# Altium project YuWatch.PrjPcb
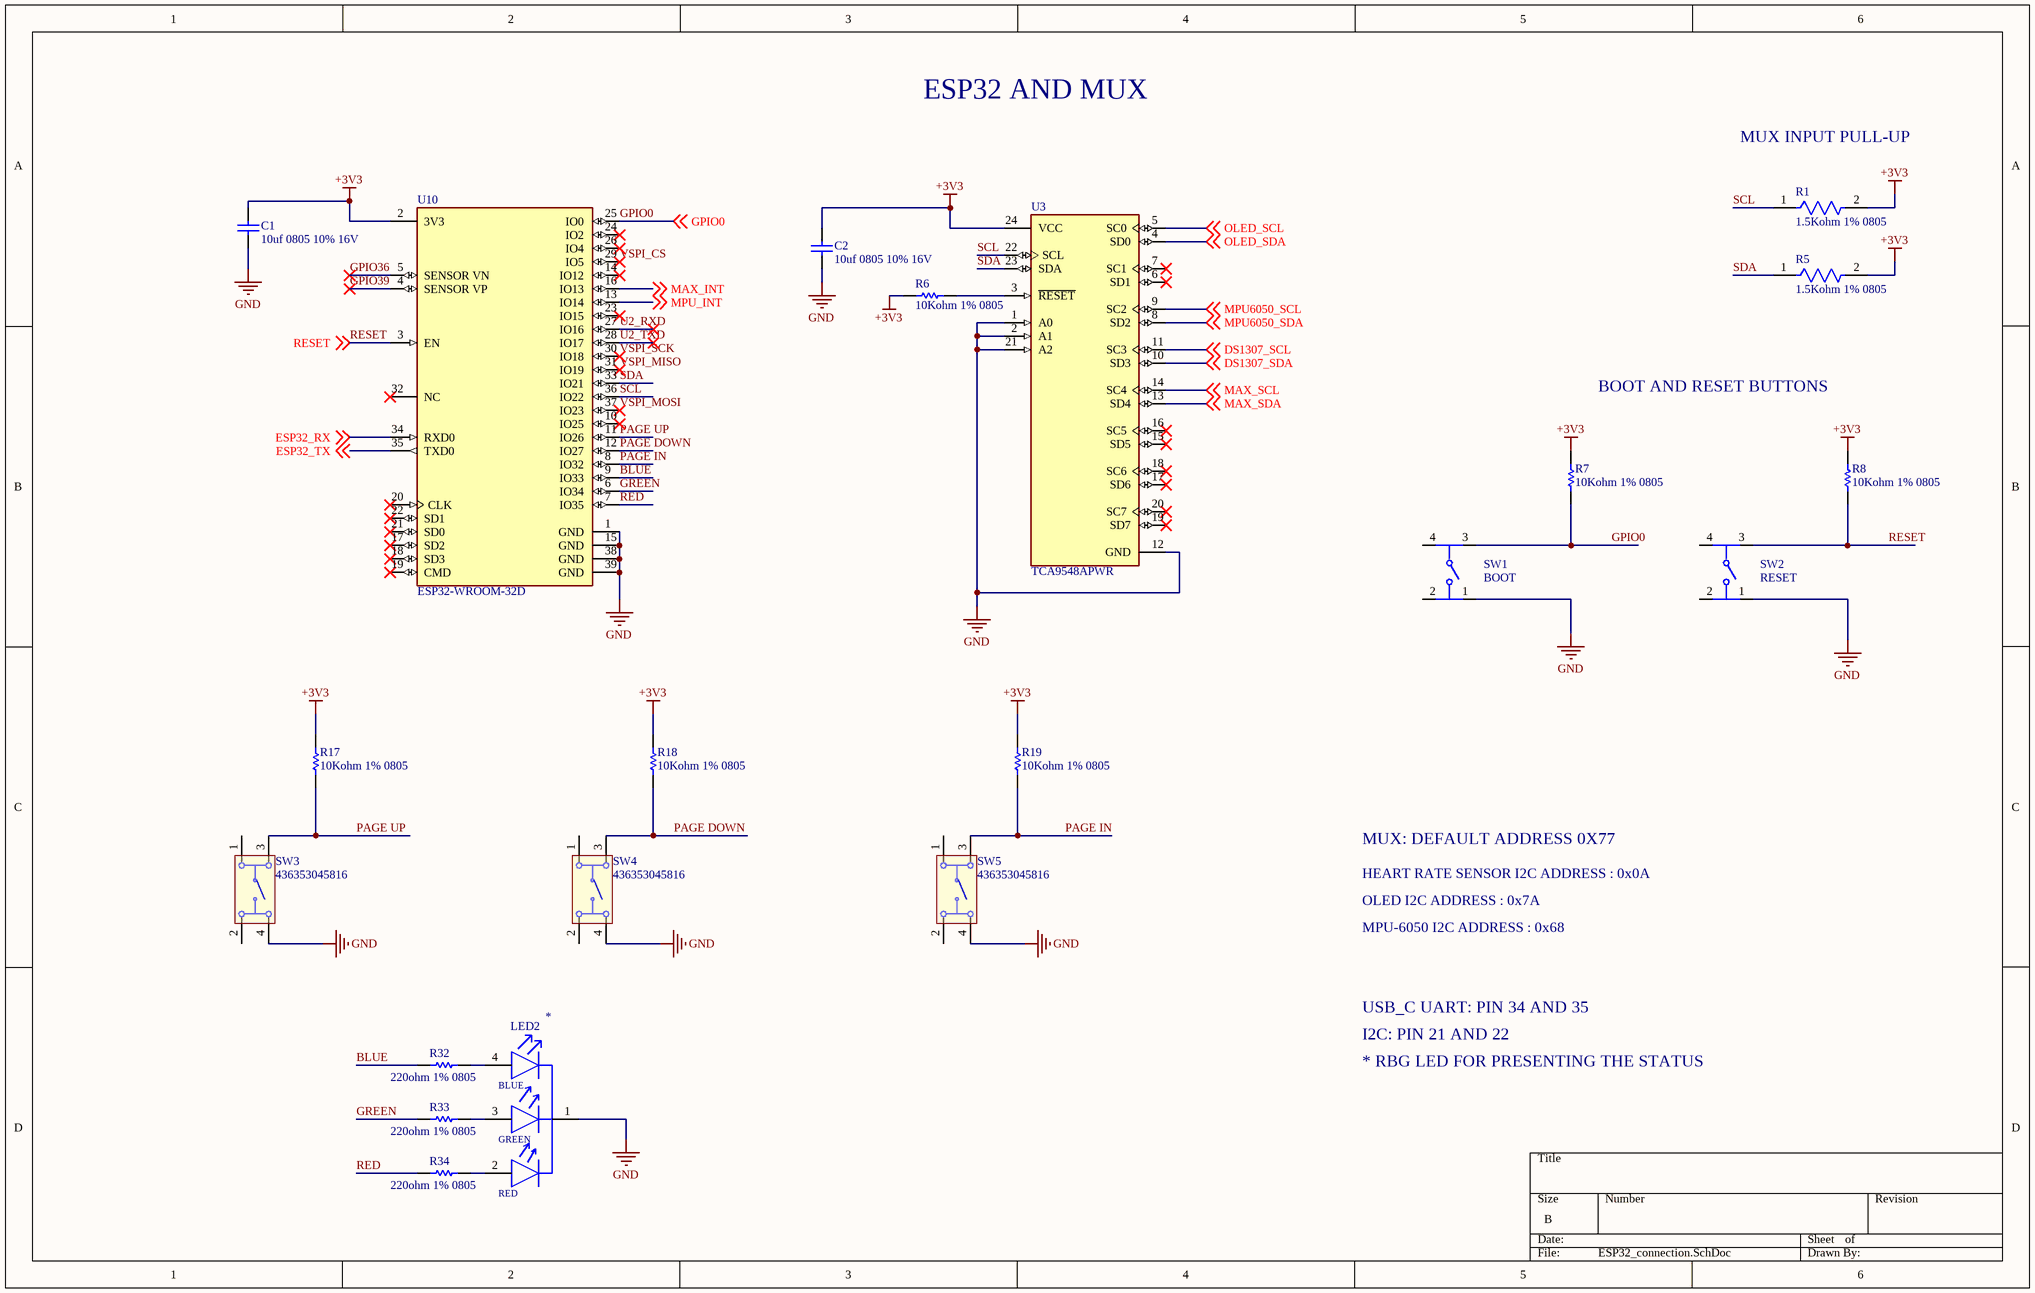
[diagram p0: ESP32_connection.SchDoc]
3 sheets, 79 parts. Net scope: global (net labels, ports and power ports of the same name join across sheets).
Board file: Yuwatch_01.PcbDoc
Sheets:
  ESP32_connection.SchDoc
  USBdrive_charging.SchDoc
  I2C bus components.SchDoc

## Sheet ESP32_connection.SchDoc
size B; SheetNumber: 1; SheetTotal: 3

### Parts
C1  10uf 0805 10% 16V  [CAPC2013X140X50ML20T25]
C2  10uf 0805 10% 16V  [CAPC2013X140X50ML20T25]
LED2  APTF1616SEJ3ZGGVBDC  [FP-APTF1616SEJ3ZGGVBDC-MFG]  (value not drawn)
R1  1.5Kohm 1% 0805  [FP-RC2012-IPC_B]
R5  1.5Kohm 1% 0805  [FP-RC2012-IPC_B]
R6  10Kohm 1% 0805  [RESC2013X60X35NL10T20]
R7  10Kohm 1% 0805  [RESC2013X60X35NL10T20]
R8  10Kohm 1% 0805  [RESC2013X60X35NL10T20]
R17  10Kohm 1% 0805  [RESC2013X60X35NL10T20]
R18  10Kohm 1% 0805  [RESC2013X60X35NL10T20]
R19  10Kohm 1% 0805  [RESC2013X60X35NL10T20]
R32  220ohm 1% 0805  [RESC2013X70X40NL20T20]
R33  220ohm 1% 0805  [RESC2013X70X40NL20T20]
R34  220ohm 1% 0805  [RESC2013X70X40NL20T20]
SW1  BOOT  [FP-PTS810_SJG_250_SMTR_LF-MFG]
SW2  RESET  [FP-PTS810_SJG_250_SMTR_LF-MFG]
SW3  436353045816  [436353045816]
SW4  436353045816  [436353045816]
SW5  436353045816  [436353045816]
U3  TCA9548APWR  [FP-PW0024A-MFG]
U10  ESP32-WROOM-32D  [FP-ESP32-WROOM-32D-MFG]

### Nets
+3V3: C1.2 C2.2 R1.2 R5.2 R6.1 R7.1 R8.1 R17.1 R18.1 R19.1 U3.8(SD2) U3.24(VCC) U10.2(3V3) ; off-sheet MPU6050_SDA  [also labelled MPU6050_SDA]
GND: C1.1 C2.1 LED2.1(COMMON_CATHODE) SW1.1 SW2.1 SW3.4 SW4.4 SW5.4 U3.1(A0) U3.2(A1) U3.12(GND) U3.21(A2) U10.1(GND) U10.15(GND) U10.38(GND) U10.39(GND)
MAX_SCL: U3.14(SC4) ; off-sheet MAX_SCL  [project net +1V8]
BLUE: R32.1 U10.9(IO33)
DS1307_SCL: U3.11(SC3) ; off-sheet DS1307_SCL
DS1307_SDA: U3.10(SD3) ; off-sheet DS1307_SDA
ESP32_RX: U10.34(RXD0) ; off-sheet ESP32_RX
ESP32_TX: U10.35(TXD0) ; off-sheet ESP32_TX
GPIO0: R7.2 SW1.3 U10.25(IO0) ; off-sheet GPIO0
GPIO36: U10.5(SENSOR_VN)
GPIO39: U10.4(SENSOR_VP)
GREEN: R33.1 U10.6(IO34)
MAX_INT: U10.16(IO13) ; off-sheet MAX_INT
MAX_SDA: U3.13(SD4) ; off-sheet MAX_SDA
MPU6050_SCL: U3.9(SC2) ; off-sheet MPU6050_SCL
MPU_INT: U10.13(IO14) ; off-sheet MPU_INT
OLED_SCL: U3.5(SC0) ; off-sheet OLED_SCL
OLED_SDA: U3.4(SD0) ; off-sheet OLED_SDA
PAGE DOWN: R18.2 SW4.3 U10.12(IO27)
PAGE IN: R19.2 SW5.3 U10.8(IO32)
PAGE UP: R17.2 SW3.3 U10.11(IO26)
RED: R34.1 U10.7(IO35)
RESET: R8.2 SW2.3 U10.3(EN) ; off-sheet RESET
SCL: R1.1 U3.22(SCL) U10.36(IO22)
SDA: R5.1 U3.23(SDA) U10.33(IO21)
U2_RXD: U10.27(IO16)
U2_TXD: U10.28(IO17)
VSPI_CS: U10.29(IO5)
VSPI_MISO: U10.31(IO19)
VSPI_MOSI: U10.37(IO23)
VSPI_SCK: U10.30(IO18)
NetLED2_2: LED2.2(RED_A) R34.2
NetLED2_3: LED2.3(GREEN_A) R33.2
NetLED2_4: LED2.4(BLUE_A) R32.2
NetR6_2: R6.2 U3.3(~{RESET})

Not connected (* = marked no-connect by the designer): SW1 2 4; SW2 2 4; SW3 1 2; SW4 1 2; SW5 1 2; U3 6(SD1)* 7(SC1)* 15(SD5)* 16(SC5)* 17(SD6)* 18(SC6)* 19(SD7)* 20(SC7)*; U10 10(IO25)* 14(IO12)* 17(SD2)* 18(SD3)* 19(CMD)* 20(CLK)* 21(SD0)* 22(SD1)* 23(IO15)* 24(IO2)* 26(IO4)* 32(NC)*

### Notes on the sheet
- ESP32 AND MUX
- MUX INPUT PULL-UP
- BOOT AND RESET BUTTONS
- MUX: DEFAULT ADDRESS 0X77
- HEART RATE SENSOR I2C ADDRESS : 0x0A
- OLED I2C ADDRESS : 0x7A
- MPU-6050 I2C ADDRESS : 0x68
- (near LED2) *
- USB_C UART: PIN 34 AND 35
- I2C: PIN 21 AND 22
- (near LED2) BLUE
- * RBG LED FOR PRESENTING THE STATUS
- (near LED2) GREEN
- (near LED2) RED

### Library data of the parts
C1 C2 = CMP-1036-04927-2: Part Number: 0805YD106KAT2A; Manufacturer: AVX Interconnect / Elco
LED2 = CMP-44529-000025-1: LED RGB CLEAR 4SMD; Luminous Intensity: 140mcd; Test Current: 20mA; Forward Voltage: 3.3V; Lens Color: Colorless; Illumination Color: Blue; Viewing Angle: 120°; Dominant Wavelength: 470nm; Width: 1.6mm; Mount: Surface Mount; Height: 0.9mm; Case/Package: 0606; Max Operating Temperature: 85°C; Color: Blue; Lens Transparency: Clear; Min Operating Temperature: -40°C; Forward Current: 20mA; Length: 1.6mm; Packaging: Tape and Reel; Package Quantity: 2000
R1 R5 = CMP-13261-002474-1: Res Thick Film 0805 1.5kΩ 1% 0.125W ±100ppm/°C Molded SMD T/R; Resistance: 1.5kR; Voltage Rating (DC): 150V; Max Power Dissipation: 125mW; Case Code (Metric): 2012; Packaging: Tape and Reel; Features: Moisture Resistant; Temperature Coefficient: 100ppm/°C; Case Code (Imperial): 0805; Min Operating Temperature: -55°C; Contact Plating: Tin; Tolerance: 1%; Composition: Thick Film; Height: 0.024inch; Lead Free: Lead Free; Max Operating Temperature: 155°C; Length: 0.079inch; Radiation Hardening: No; Case/Package: 0805; Width: 0.049inch; Number of Terminations: 2
R6-R8 R17-R19 = CMP-1659-00013-4: Chip Resistor, 10 KOhm, +/- 1%, 0.125 W, -55 to 155 degC, 0805 (2012 Metric), RoHS, Tape and Reel; Manufacturer: Yageo; Voltage Rating: 150 V; Mount: Surface Mount; ComponentLink1Description: Manufacturer URL; ComponentLink2URL: http://www.yageo.com/documents/recent/PYu-RC_Group_51_RoHS_L_04.pdf; Pins: 2; Length: 2 mm; Min Operating Temperature: -55 degC; Height: 0.5 mm; Mounting Technology: Surface Mount; RoHSCompliant: true; REACH SVHC: No SVHC; ComponentLink1URL: http://www.yageo.com/; Max Operating Temperature: 155 degC; PackageReference: 0805; DatasheetVersion: Rev. 4, 02/2016; Package Quantity: 5000; Packaging: Tape and Reel; ComponentLink2Description: Datasheet; PackageDescription: 2-Pin Surface Mounted Device, Body 2 x 1.25 mm
R32-R34 = CMP-2001-00044-1: Part Number: ERJ6ENF2200V; Manufacturer: Panasonic
SW1 SW2 = CMP-10040-000011-1: SWITCH TACTILE SPST-NO 0.05A 16V; Manufacturer: C&K Components; Manufacturer Part Number: PTS810 SJG 250 SMTR LFS; Electromechanical Life: 100000Cycles; Contact Resistance: 500mΩ; Operating Force: 400gf; Current Rating: 50mA; Voltage Rating Dc: 16V; Device Class L2: Switches; Device Class L1: Electromechanical; ComponentLink2URL: https://www.ckswitches.com/media/1476/pts810.pdf; Digikey Description: SWITCH TACTILE SPST-NO 0.05A 16V; RoHS: TRUE; Temperature Range Low: -40°C; Temperature Range High: +85°C; Automotive: No; Category: Switch; ComponentLink2Description: Datasheet; Device Class L3: Tactile Switches; Mouser Description: Switch Tactile N.O. SPST Button J-Bend 0.05A 16VDC 100000Cycles 3.92N SMD T/R; Throw Configuration: SPST-NO; Package: PTS810 SJG 250 SMTR LFS; Height: 2.7mm; Octopart: https://octopart.com/pts810sjg250smtrlfs-c%26k+components-29380277; Temperature: -40°C to +85°C; Lead Free: Yes
SW3-SW5 = CMP-1464-00002-1: WS-TASU J-Bend J-Bend SMD Tact Switch with boss design 4.7X3.5 mm side push; Manufacturer: Wuerth Elektronik; ComponentLink1Description: Manufacturer URL; ComponentLink2Description: Datasheet; PackageReference: 436353045816; ComponentLink1URL: http://www.we-online.com; PartNumber: 436353045816; ComponentLink2URL: http://katalog.we-online.de/em/datasheet/436353045816.pdf
U3 = CMP-04892-000002-1: IC I2C SW 8CH W/RESET 24TSSOP; Manufacturer: Texas Instruments; Number Of Circuits: 1; Mux Demux Ratio: 1:8; Nominal Supply Current: 2-50uA; Interface: I2C,SMBus; Min Supply Voltage: 1.65V; Standoff Height: 0.05mm; Max Supply Voltage: 5.5V; Device Class L2: Interface ICs; ComponentLink2Description: Datasheet; Ipc Land Pattern Name: SOP65P640X120-24; Category: IC; Device Class L1: Integrated Circuits (ICs); Manufacturer Part Number: TCA9548APWR; RoHS: TRUE; Temperature Range High: +85°C; Digikey Description: IC I2C SW 8CH W/RESET 24TSSOP; Temperature Range Low: -40°C; Lead Free: Yes; Package: PW0024A; ComponentLink2URL: http://www.ti.com/lit/ds/symlink/tca9548a.pdf; Device Class L3: Multiplexers; Ambient Temperature Range Low: -40°C; Mouser Description: Low-Voltage 8-Channel I2C Switch With Reset 24-TSSOP -40 to 85; Temperature: -40°C to +85°C; Octopart: https://octopart.com/tca9548apwr-texas+instruments-22266789; Ambient Temperature Range High: +85°C; Automotive: No; Height: 1.2mm
U10 = CMP-194065-000003-1: WIFI MODULE 32MBITS SPI FLASH; Manufacturer: Espressif Systems; Max Supply Voltage: 3.6V; Nominal Supply Current: 500mA; Max Frequency: 2484MHz; Number Of Adc Channels: 16; Number Of Gpio: 32; Interface: I2C,SPI,UART,Ethernet,I2S,Other; Data Rate: 150Mbits/s; Min Supply Voltage: 3V; Bandwidth: 72MHz; Sensitivity: -98dBm; Octopart: https://octopart.com/esp32-wroom-32d-espressif+systems-91040050; Package: ESP32-WROOM-32D; ComponentLink2URL: https://www.espressif.com/sites/default/files/documentation/esp32-wroom-32d_esp32-wroom-32u_datasheet_en.pdf; Lead Free: Yes; Category: UNK; Mouser Description: Wi-Fi/BT BLE Module ESP32-D0WD, SPI Flash, UART, P; Device Class L1: Integrated Circuits (ICs); RoHS: TRUE; Temperature Range Low: -40°C; ComponentLink2Description: Datasheet; Digikey Description: WIFI MODULE 32MBITS SPI FLASH; Height: 3.2mm; Temperature: -40°C to +85°C; Manufacturer Part Number: ESP32-WROOM-32D; Device Class L3: Transceivers; Device Class L2: RF Semiconductors and Devices; Temperature Range High: +85°C; Automotive: No

## Sheet USBdrive_charging.SchDoc
size B; SheetNumber: 2; SheetTotal: 3
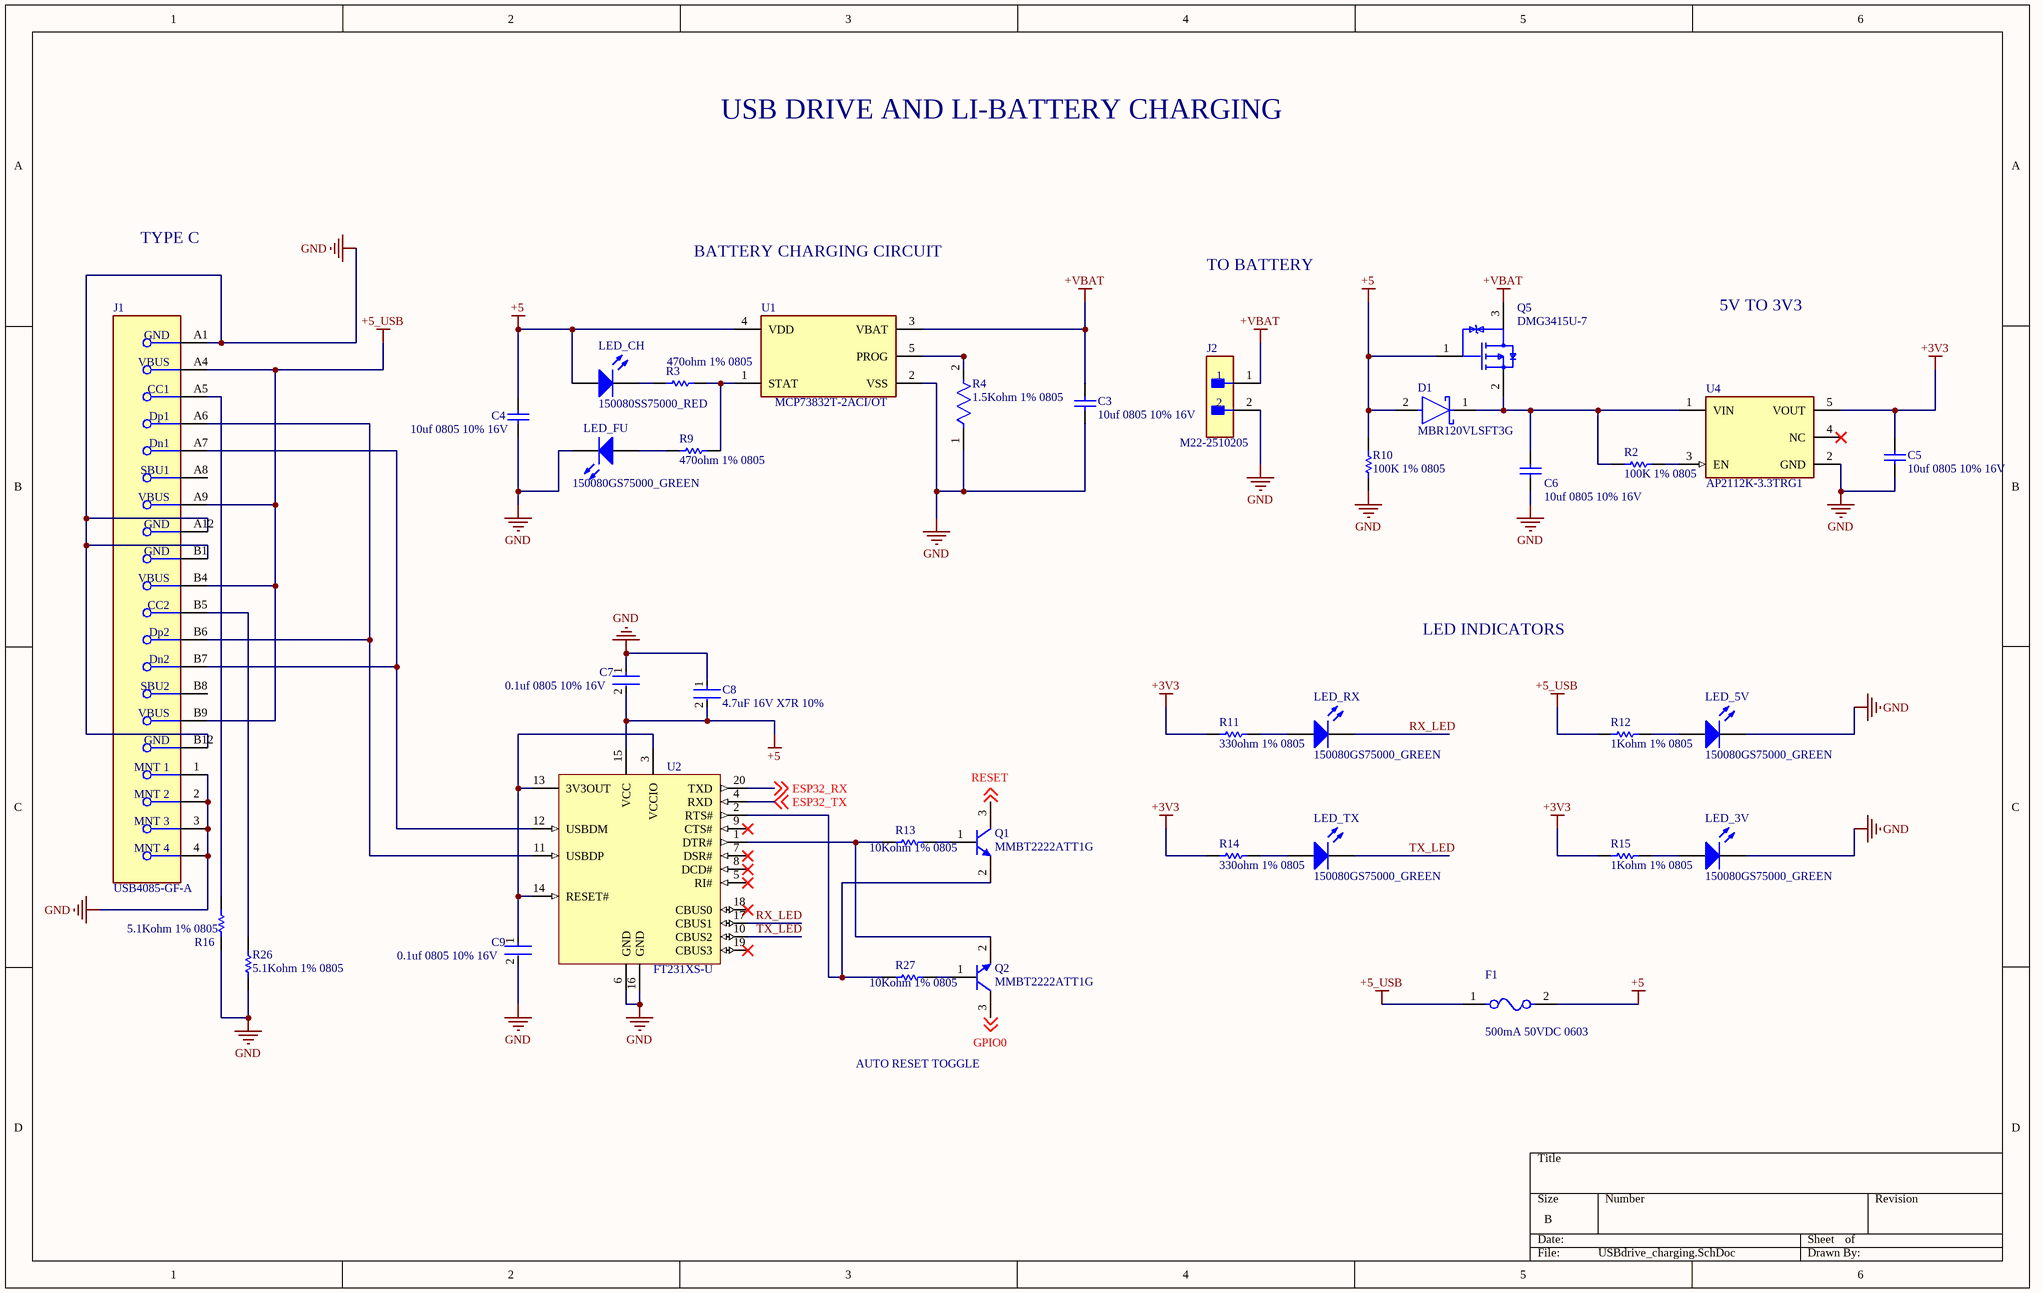
[diagram p1: USBdrive_charging.SchDoc]

### Parts
C3  10uf 0805 10% 16V  [CAPC2013X140X50ML20T25]
C4  10uf 0805 10% 16V  [CAPC2013X140X50ML20T25]
C5  10uf 0805 10% 16V  [CAPC2013X140X50ML20T25]
C6  10uf 0805 10% 16V  [CAPC2013X140X50ML20T25]
C7  0.1uf 0805 10% 16V  [FP-CC0805-0_85-MFG]
C8  4.7uF 16V X7R 10%  [FP-CGA4J-IPC_A]
C9  0.1uf 0805 10% 16V  [FP-CC0805-0_85-MFG]
D1  MBR120VLSFT3G  [FP-498-MFG]
F1  500mA 50VDC 0603  [FP-SF-0603S-MFG]
J1  USB4085-GF-A  [FP-USB4085-GF-A-MFG]
J2  M22-2510205  [FP-M22-2510205-MFG]
LED_3V  150080GS75000_GREEN  [0805_A]
LED_5V  150080GS75000_GREEN  [0805_A]
LED_CH  150080SS75000_RED  [0805_A]
LED_FU  150080GS75000_GREEN  [0805_A]
LED_RX  150080GS75000_GREEN  [0805_A]
LED_TX  150080GS75000_GREEN  [0805_A]
Q1  MMBT2222ATT1G  [ONSC-SC-75-3-463-01_V]
Q2  MMBT2222ATT1G  [ONSC-SC-75-3-463-01_V]
Q5  DMG3415U-7  [DMG3415U]
R2  100K 1% 0805  [RESC2013X60X35ML10T20]
R3  470ohm 1% 0805  [RESC2013X50X30LL20T20]
R4  1.5Kohm 1% 0805  [FP-RC2012-IPC_B]
R9  470ohm 1% 0805  [RESC2013X50X30LL20T20]
R10  100K 1% 0805  [RESC2013X60X35ML10T20]
R11  330ohm 1% 0805  [RESC2013X70X40ML20T20]
R12  1Kohm 1% 0805  [RESC2013X70X40ML20T20]
R13  10Kohm 1% 0805  [RESC2013X60X35NL10T20]
R14  330ohm 1% 0805  [RESC2013X70X40ML20T20]
R15  1Kohm 1% 0805  [RESC2013X70X40ML20T20]
R16  5.1Kohm 1% 0805  [RESC2013X50X30LL20T20]
R26  5.1Kohm 1% 0805  [RESC2013X70X40ML20T20]
R27  10Kohm 1% 0805  [RESC2013X60X35NL10T20]
U1  MCP73832T-2ACI/OT  [FP-C04-091-OT-MFG]
U2  FT231XS-U  [SSOP-20_L]
U4  AP2112K-3.3TRG1  [FP-SOT25-IPC_A]

### Nets
+3V3: C5.2 R11.1 R14.1 R15.1 U4.5(VOUT)
+5: C4.2 C7.2 C8.2 D1.2(A) F1.2 LED_CH.2(A) Q5.1(G) R10.2 U1.4(VDD) U2.15(VCC)
+5_USB: F1.1 J1.A4(VBUS) J1.A9(VBUS) J1.B4(VBUS) J1.B9(VBUS) R12.1
+VBAT: C3.2 J2.1 Q5.3(D) U1.3(VBAT)
GND: C3.1 C4.1 C5.1 C6.1 C7.1 C8.1 C9.2 J1.1(MNT_1) J1.2(MNT_2) J1.3(MNT_3) J1.4(MNT_4) J1.A1(GND) J1.A12(GND) J1.B1(GND) J1.B12(GND) J2.2 LED_3V.1(K) LED_5V.1(K) LED_FU.1(K) R4.1 R10.1 R16.1 R26.1 U1.2(VSS) U2.6(GND) U2.16(GND) U4.2(GND)
ESP32_RX: U2.20(TXD) ; off-sheet ESP32_RX
ESP32_TX: U2.4(RXD) ; off-sheet ESP32_TX
GPIO0: Q2.3(C) ; off-sheet GPIO0
RESET: Q1.3(C) ; off-sheet RESET
RX_LED: LED_RX.1(K) U2.17(CBUS1)
TX_LED: LED_TX.1(K) U2.10(CBUS2)
NetC6_2: C6.2 D1.1(C) Q5.2(S) R2.2 U4.1(VIN)
NetC9_1: C9.1 U2.3(VCCIO) U2.13(3V3OUT) U2.14(RESET#)
NetJ1_A5: J1.A5(CC1) R16.2
NetJ1_A6: J1.A6(Dp1) J1.B6(Dp2) U2.11(USBDP)
NetJ1_A7: J1.A7(Dn1) J1.B7(Dn2) U2.12(USBDM)
NetJ1_B5: J1.B5(CC2) R26.2
NetLED_3V_2: LED_3V.2(A) R15.2
NetLED_5V_2: LED_5V.2(A) R12.2
NetLED_CH_1: LED_CH.1(K) R3.1
NetLED_FU_2: LED_FU.2(A) R9.1
NetLED_RX_2: LED_RX.2(A) R11.2
NetLED_TX_2: LED_TX.2(A) R14.2
NetQ1_1: Q1.1(B) R13.2
NetQ1_2: Q1.2(E) R27.1 U2.2(RTS#)
NetQ2_1: Q2.1(B) R27.2
NetQ2_2: Q2.2(E) R13.1 U2.1(DTR#)
NetR2_1: R2.1 U4.3(EN)
NetR3_2: R3.2 R9.2 U1.1(STAT)
NetR4_2: R4.2 U1.5(PROG)

Not connected (* = marked no-connect by the designer): J1 A8(SBU1) B8(SBU2); U2 5(RI#)* 7(DSR#)* 8(DCD#)* 9(CTS#)* 18(CBUS0)* 19(CBUS3)*; U4 4(NC)*

### Notes on the sheet
- USB DRIVE AND LI-BATTERY CHARGING
- TYPE C
- BATTERY CHARGING CIRCUIT
- TO BATTERY
- 5V TO 3V3
- LED INDICATORS
- AUTO RESET TOGGLE

### Library data of the parts
C3-C6 = CMP-1036-04927-2: as C1 on sheet ESP32_connection
C7 C9 = CMP-1036-04402-6: CAP CER 0.1UF 16V X7R 0805; Manufacturer Part Number: CC0805KRX7R7BB104; Manufacturer: Yageo; Material: Ceramic; Tolerance: 0.1; Capacitance: 100 nF; Value: 100 nF; Temperature: -30°C to +85°C; Lead Free: Yes; Footprint Url: http://www.yageo.com/exep/pages/download/literatures/UPY-C_GEN_24.pdf; Voltage Rating: 16 V; Package: CC0805-0.85; RoHS: TRUE; Digikey Description: CAP CER 0.1UF 16V X7R 0805; Category: Cap; Octopart: https://octopart.com/cc0805krx7r7bb104-yageo-39467769; Device Class L3: Ceramic Capacitors; ComponentLink2URL: http://www.yageo.com/documents/recent/UPY-GPHC_Y5V_6.3V-to-50V_8.pdf; Temperature Range Low: -30°C; Mouser Description: Multilayer Ceramic Capacitors MLCC - SMD/SMT 100nF 16V X7R 10%; Automotive: No; Device Class L2: Capacitors; Height: 0.95mm; ComponentLink2Description: Datasheet; Temperature Characteristic: X7R; Ipc Land Pattern Name: CAPC200125X85; Device Class L1: Passive Components; Temperature Range High: +85°C
C8 = CMP-08246-002090-1: Cap Ceramic 4.7uF 16V X7R 10% Pad SMD 0805 +125°C Automotive T/R; Lead Free: Lead Free; Weight: 0.000194oz; Composition: Ceramic; Tolerance: 10%; Case/Package: 0805; Min Operating Temperature: -55°C; Case Code (Metric): 2012; Mount: Surface Mount; Thickness: 0.057inch; REACH SVHC: No SVHC; Package Quantity: 1; Termination: SMD/SMT; Max Operating Temperature: 125°C; Length: 2mm; Height: 1.25mm; Width: 0.049inch; Depth: 1.25mm; Dielectric: X7R; Ratings: AEC-Q200; Case Code (Imperial): 0805; Packaging: Tape and Reel; Capacitance: 4.7uF; Radiation Hardening: No; Voltage Rating (DC): 16V; Voltage Rating: 16V
D1 = CMP-1055-00447-2: DIODE SCHOTTKY 20V 1A SOD123FL; Peak Reverse Current: 600uA; Peak Non-Repetitive Surge Current: 45A; Forward Voltage: 340mV; Polarity: Standard; Element Configuration: Single; Max Repetitive Reverse Voltage (Vrrm): 20V; Max Operating Temperature: 125°C; Forward Current: 1A; Average Rectified Current: 1A; Package Quantity: 10000; Current Rating: 1A; Max Reverse Leakage Current: 600uA; Max Surge Current: 45A; Radiation Hardening: No; Min Operating Temperature: -65°C; Max Reverse Voltage (DC): 20V; Number of Pins: 2; Output Current: 1A; Halogen Free: Halogen Free; Packaging: Tape and Reel; Max Forward Surge Current (Ifsm): 45A; REACH SVHC: No SVHC; Voltage Rating (DC): 20V; Lead Free: Lead Free
F1 = CMP-07399-000004-1: FUSE BOARD MNT 500MA 50VDC 0603; Manufacturer: Bourns Inc.; Manufacturer Part Number: SF-0603S050-2; Fuse I2T: 0.009A2Sec; Fuse Current: 0.5A; Fuse Interrupt Ac Current: 50A; Max Fuse Ac Voltage: 35V; Resistance: 232mΩ; Fuse Blow Speed: Slow; Value: 232mΩ; Max Fuse Dc Voltage: 50V; Automotive: No; Category: Fuse; Temperature Range High: +105°C; Device Class L1: Circuit Protection; Height: 0.55mm; RoHS: TRUE; ComponentLink2URL: https://www.bourns.com/docs/product-datasheets/sf0603s.pdf; Ipc Land Pattern Name: CAPC16080X45; Temperature Range Low: -20°C; Mouser Description: Surface Mount Fuses 0.50A Slow Blow SinglFuse; Package: SF-0603S; Device Class L3: unset; Digikey Description: FUSE BOARD MNT 500MA 50VDC 0603; Device Class L2: Fuses; Lead Free: Yes; Temperature: -20°C to +105°C; ComponentLink2Description: Datasheet; Octopart: https://octopart.com/sf-0603s050-2-bourns-10486821; Fuse Interrupt Dc Current: 50A
J1 = CMP-196119-000001-1: CONN RCPT USB2.0 TYPEC 16POS; Manufacturer: Global Connector Technology; Voltage Rating: 20V; Conn Orientation: Right Angle; Shielding: true; Current Rating: 4.25A; Number Of Contacts: 16; Pitch: 0.85mm; Is Female: yes; ComponentLink2URL: https://gct.co/files/drawings/usb4085.pdf; Category: Conn; Automotive: No; ComponentLink2Description: Datasheet; Height: 3.66mm; Manufacturer Part Number: USB4085-GF-A; Package: 0; Usb Standard: USB 2.0; Octopart: https://octopart.com/usb4085-gf-a-global+connector+technology-94773699; Device Class L3: unset; Digikey Description: CONN RCPT USB2.0 TYPEC 16POS; Temperature Range Low: -40°C; Temperature: -40°C to +85°C; Lead Free: Yes; Contact Material: Gold,Nickel; Device Class L1: Connectors; Temperature Range High: +85°C; Device Class L2: USB Connectors; RoHS: TRUE
J2 = CMP-15831-000005-1: CONN HEADER VERT 2POS 2MM; Manufacturer: Harwin; Conn Gender: Male; Current Rating: 2A; Number Of Contacts: 2; Conn Orientation: Vertical; Temperature Range Low: -40°C; Device Class L1: Connectors; ComponentLink2URL: https://cdn.harwin.com/pdfs/C018XX_M22_Series_Connectors.pdf; Temperature Range High: +105°C; Pitch: 2mm; Number Of Rows: 1; Temperature: -40°C to +105°C; Automotive: No; Device Class L3: unset; Octopart: https://octopart.com/m22-2510205-harwin-2538221; Mouser Description: Headers & Wire Housings 2 PIN SIL VERTICAL GOLD PIN HEADER; Height: 5.45mm; Category: Conn; Digikey Description: CONN HEADER VERT 2POS 2MM; Contact Material: Gold,Nickel; Lead Free: Yes; ComponentLink2Description: Datasheet; Manufacturer Part Number: M22-2510205; Device Class L2: Headers and Wire Housings; Package: 0; Footprint Url: https://cdn.harwin.com/pdfs/M22-251.pdf; RoHS: TRUE
LED_3V LED_5V LED_FU LED_RX LED_TX = CMP-1426-00007-1: SMD mono-color Chip LED, WL-SMCW, Green; Manufacturer: Wuerth Elektronik; PackageReference: 0805_A; Color: Green; PartNumber: 150080GS75000; ComponentLink2URL: http://katalog.we-online.com/led/datasheet/150080GS75000.pdf; ComponentLink1URL: http://www.we-online.com; ComponentLink1Description: Manufacturer URL; ComponentLink2Description: Datasheet
LED_CH = CMP-1426-00010-1: SMD mono-color Chip LED, WL-SMCW, Super Red; Manufacturer: Wuerth Elektronik; PackageReference: 0805_A; ComponentLink2URL: http://katalog.we-online.com/led/datasheet/150080SS75000.pdf; ComponentLink1URL: http://www.we-online.com; Color: Super Red; ComponentLink2Description: Datasheet; ComponentLink1Description: Manufacturer URL; PartNumber: 150080SS75000
Q1 Q2 = CMP-1048-00417-1: General Purpose Transistor, NPN Silicon, 3-Pin SC-75, Pb-Free, Tape and Reel; Manufacturer: On Semiconductor; IC Continuous (A): 0.6; fT Min (MHz): 300; DatasheetVersion: Rev. 5; PackageVersion: Rev. F, 07/2005; ComponentLink1Description: Manufacturer URL; RoHS: TRUE; Packing: Tape and Reel; ComponentLink3URL: http://www.onsemi.com/pub_link/Collateral/463-01.PDF; ComponentLink1URL: http://www.onsemi.com/; ComponentLink3Description: Package Specification; ComponentLink2URL: http://www.onsemi.cn/pub_link/Collateral/MMBT2222ATT1-D.PDF; Mounting Technology: Surface Mount; PartNumber: MMBT2222ATT1G; ComponentLink2Description: Datasheet; Polarity: NPN; PackageReference: SC-75-3-463-01; PackageDescription: 3-Pin Small Outline Transistor, Body 1.6 x 0.8 mm, Pitch 0.5 mm
Q5 = DMG3415U-7: MOSFET P-CH 20V 4A SOT-23; Manufacturer: Diodes; Rise Time: 117ns; Gate to Source Voltage (Vgs): 8V; Fall Time: 393ns; Turn-Off Delay Time: 795ns; Turn-On Delay Time: 71ns; Rds On Max: 39mR; Input Capacitance: 294pF; Max Power Dissipation: 900mW; Number of Elements: 1; Drain to Source Resistance: 42.5mR; Element Configuration: Single; Drain to Source Breakdown Voltage: -20V; Nominal Vgs: -550mV; Polarity: P-CHANNEL; Supplier 1: Digi-Key; Manufacturer Part Number: DMG3415U-7; RoHS: Yes; Category: MOSFETs; Stock 1: 24000; Pricing 1: 1=0.43000, 10=0.30500, 25=0.29160, 100=0.15370, 500=0.13620, 1000=0.10600 (USD); Mount: Surface Mount; Case/Package: SOT-23; Number of Pins: 3; Weight: 0.000282oz; Contact Plating: Tin,Matte; Min Operating Temperature: -55°C; Max Operating Temperature: 150°C; Continuous Drain Current (ID): 4A; Packaging: Tape and Reel; Drain to Source Voltage (Vdss): 20V; Package Quantity: 3000; Number of Channels: 1; Power Dissipation: 900mW; On-State Resistance: 42.5mR; Threshold Voltage: -550mV; Series: -; Drain-source On Resistance-Max: 42.5mR; Length: 2.9mm; Width: 1.3mm; Height: 1mm; Radiation Hardening: No; REACH SVHC: No SVHC; Lead Free: Lead Free; RoHS Compliant: Yes; ComponentLink1URL: https://datasheet.ciiva.com/11174/ds31735-11174977.pdf?src-supplier=Avnet; ComponentLink1Description: https://datasheet.ciiva.com/11174/ds31735-11174977.pdf?src-supplier=Avnet; ComponentLink2URL: https://datasheet.ciiva.com/13061/ds31735-64958-13061831.pdf?src-supplier=Mouser; ComponentLink2Description: https://datasheet.ciiva.com/13061/ds31735-64958-13061831.pdf?src-supplier=Mouser; ComponentLink3URL: https://datasheet.ciiva.com/935/ds31735-935015.pdf?src-supplier=Digi-Key; ComponentLink3Description: https://datasheet.ciiva.com/935/ds31735-935015.pdf?src-supplier=Digi-Key; ComponentLink4URL: https://datasheet.ciiva.com/8023/ds31735-8023980.pdf?src-supplier=Element14; ComponentLink4Description: https://datasheet.ciiva.com/8023/ds31735-8023980.pdf?src-supplier=Element14; ComponentLink5URL: https://datasheet.ciiva.com/8115/ds31735-8115357.pdf?src-supplier=Avnet; ComponentLink5Description: https://datasheet.ciiva.com/8115/ds31735-8115357.pdf?src-supplier=Avnet; ComponentLink6URL: https://datasheet.ciiva.com/16387/ds31735-16387485.pdf?src-supplier=Future+Electronics; ComponentLink6Description: https://datasheet.ciiva.com/16387/ds31735-16387485.pdf?src-supplier=Future+Electronics; ComponentLink7URL: https://datasheet.ciiva.com/935/ds31735-935013.pdf?src-supplier=Digi-Key; ComponentLink7Description: https://datasheet.ciiva.com/935/ds31735-935013.pdf?src-supplier=Digi-Key; ComponentLink8URL: https://datasheet.ciiva.com/935/ds31735-935014.pdf?src-supplier=Digi-Key; ComponentLink8Description: https://datasheet.ciiva.com/935/ds31735-935014.pdf?src-supplier=Digi-Key; ComponentLink9URL: https://datasheet.ciiva.com/22712/1915618-22712394.pdf?src-supplier=Element14; ComponentLink9Description: https://datasheet.ciiva.com/22712/1915618-22712394.pdf?src-supplier=Element14; Supplier Part Number 1: DMG3415UDICT-ND
R2 R10 = CMP-2100-03668-1: Chip Resistor, 100 KOhm, +/- 1%, 0.125 W, -55 to 155 degC, 0805 (2012 Metric), RoHS, Tape and Reel; Manufacturer: Yageo; Max Power Dissipation: 125mW; Voltage Rating: 150V; Temperature Coefficient: 100ppm/degreesC; Manufacturer URL: http://www.yageo.com/; Min Operating Temperature: -55degC; Lead Pitch: 0.4mm; Composition: ThickFilm; Case Code (Metric): 2012; Military Standard: Not; Package Description: 2-Pin Surface Mounted Device, Body 2 x 1.25 mm; REACH SVHC: Unknown; RoHSCompliant: true; Depth: 1.25mm; Number of Pins: 2; Lead Free: LeadFree; Resistance: 100KOhm; Datasheet URL: http://www.yageo.com/NewPortal/yageodocoutput?fileName=/pdf/R-Chip/PYu-RC_Group_51_RoHS_L_5.pdf; Max Operating Temperature: 155degC; Case/Package: 0805; Package Quantity: 1; Case Code (Imperial): 0805; Power Rating: 125mW; Width: 0.049inch; Package Reference: 0805; Height: 0.024inch; Termination: SMD/SMT; Tolerance: 1%; Datasheet Version: Rev. 5, 10/2016; Length: 2mm; Voltage Rating (DC): 150V; Number of Terminations: 2; Packaging: TapeandReel
R3 R9 R16 = CMP-2001-03932-1: Manufacturer: Vishay Dale; Part Number: CRCW0805470RFKEA
R4 = CMP-13261-002474-1: as R1 on sheet ESP32_connection; Case Code (Metric): 2012; Packaging: Tape and Reel; Features: Moisture Resistant; Temperature Coefficient: 100ppm/°C; Case Code (Imperial): 0805; Min Operating Temperature: -55°C; Contact Plating: Tin; Tolerance: 1%; Composition: Thick Film; Height: 0.024inch; Lead Free: Lead Free; Max Operating Temperature: 155°C; Length: 0.079inch; Radiation Hardening: No; Case/Package: 0805; Width: 0.049inch; Number of Terminations: 2
R11 R14 = CMP-2001-00532-1: Manufacturer: Panasonic; Part Number: ERJ6ENF3300V
R12 R15 = CMP-2001-04375-5: Chip Resistor, 1 KOhm, +/- 1%, 0.125 W, -55 to 155 degC, 0805 (2012 Metric), RoHS, Tape and Reel; Manufacturer: Panasonic; Voltage Rating: 150 V; ComponentLink1URL: http://www.panasonic.com/; ComponentLink2Description: Datasheet; REACH SVHC: Yes; ComponentLink1Description: Manufacturer URL; Length: 2 mm; Height: 0.6 mm; Package Quantity: 1; PackageDescription: 2-Pin Surface Mount Device, Body 2 x 1.25 mm; Packaging: Cut Tape; PackageReference: 0805; Max Operating Temperature: 155 degC; Mounting Technology: Surface Mount; ComponentLink2URL: http://industrial.panasonic.com/cdbs/www-data/pdf/RDA0000/AOA0000C86.pdf; DatasheetVersion: 04/2015; Min Operating Temperature: -55 degC; RoHSCompliant: true; Mount: Surface Mount
R13 R27 = CMP-1659-00013-4: as R6 on sheet ESP32_connection; Mount: Surface Mount; ComponentLink1Description: Manufacturer URL; ComponentLink2URL: http://www.yageo.com/documents/recent/PYu-RC_Group_51_RoHS_L_04.pdf; Pins: 2; Length: 2 mm; Min Operating Temperature: -55 degC; Height: 0.5 mm; Mounting Technology: Surface Mount; RoHSCompliant: true; REACH SVHC: No SVHC; ComponentLink1URL: http://www.yageo.com/; Max Operating Temperature: 155 degC; PackageReference: 0805; DatasheetVersion: Rev. 4, 02/2016; Package Quantity: 5000; Packaging: Tape and Reel; ComponentLink2Description: Datasheet; PackageDescription: 2-Pin Surface Mounted Device, Body 2 x 1.25 mm
R26 = CMP-2001-00553-1: Part Number: ERJ6ENF5101V; Manufacturer: Panasonic
U1 = CMP-0133-00138-2: IC LI-ION/LI-POLY CTRLR SOT23-5; Output Current: 10mA; Output Voltage: 4.2V; Max Output Current: 500mA; Max Power Dissipation: 1.54W; Min Output Voltage: 4.168V; Number of Channels: 1; Max Supply Voltage: 6V; Min Supply Voltage: 3.75V; Max Output Voltage: 4.5V; Case/Package: SOT-23; Lead Free: Lead Free; Termination: SMD/SMT; Min Operating Temperature: -40°C; Max Operating Temperature: 85°C; Height: 1.3mm; Length: 3.1mm; Mount: Surface Mount; Package Quantity: 3000; Number of Pins: 5; Packaging: Tape and Reel; REACH SVHC: No SVHC; Contact Plating: Tin; Width: 1.8mm; Number of Cells: 1; Number of Outputs: 1; Power Dissipation: 1.54W; Max Charge Current: 500mA; Max Input Voltage: 6V; Radiation Hardening: No
U2 = CMP-0248-00015-2: USB to Full-Handshake UART Interface Chip, UHCI/OHCI/EHCI Compatible, USB 2.0 Compatible, -40 to +85 degC, 20-Pin SSOP, Pb-Free, Tube; Manufacturer: FTDI; PackageDescription: 20-Pin Small Outline Package, 8.6 x 3.9 mm Body, 0.635 mm Pitch; ComponentLink2Description: Datasheet; DatasheetVersion: ver 1.2, Feb-2013; PackageReference: SSOP-20; ComponentLink3URL: www.ftdichip.com/Products/ICs/FT231X.html; ComponentLink2URL: http://www.ftdichip.com/Support/Documents/DataSheets/ICs/DS_FT231X.pdf; PartNumber: FT231XS-U; ComponentLink3Description: FT231X Product Page; ComponentLink1URL: http://www.ftdichip.com/; Code_JEDEC: MO-137-AD; ComponentLink1Description: Manufacturer URL; RevisionNote: DatasheetVersion updated to 1.2 Feb-2013; PackageVersion: Feb-13
U4 = CMP-12756-000035-1: IC REG LINEAR 3.3V 600MA SOT25; Number of Regulators: 1; Output Type: Fixed; Polarity: Positive; Min Input Voltage: 2.5V; Max Input Voltage: 6V; Accuracy: 1.5%; Quiescent Current: 55uA; Dropout Voltage: 250mV; Min Operating Temperature: -40°C; Length: 3.1mm; Output Current: 600mA; Max Operating Temperature: 85°C; Package Quantity: 1; Output Voltage: 3.3V; Width: 1.7mm; Number of Outputs: 1; Packaging: Tape and Reel; Height: 1.3mm; Lead Free: Lead Free; Max Output Current: 600mA; Case/Package: SOT-23-5; Mount: Surface Mount; Number of Pins: 5

## Sheet I2C bus components.SchDoc
size B; SheetNumber: 3; SheetTotal: 3
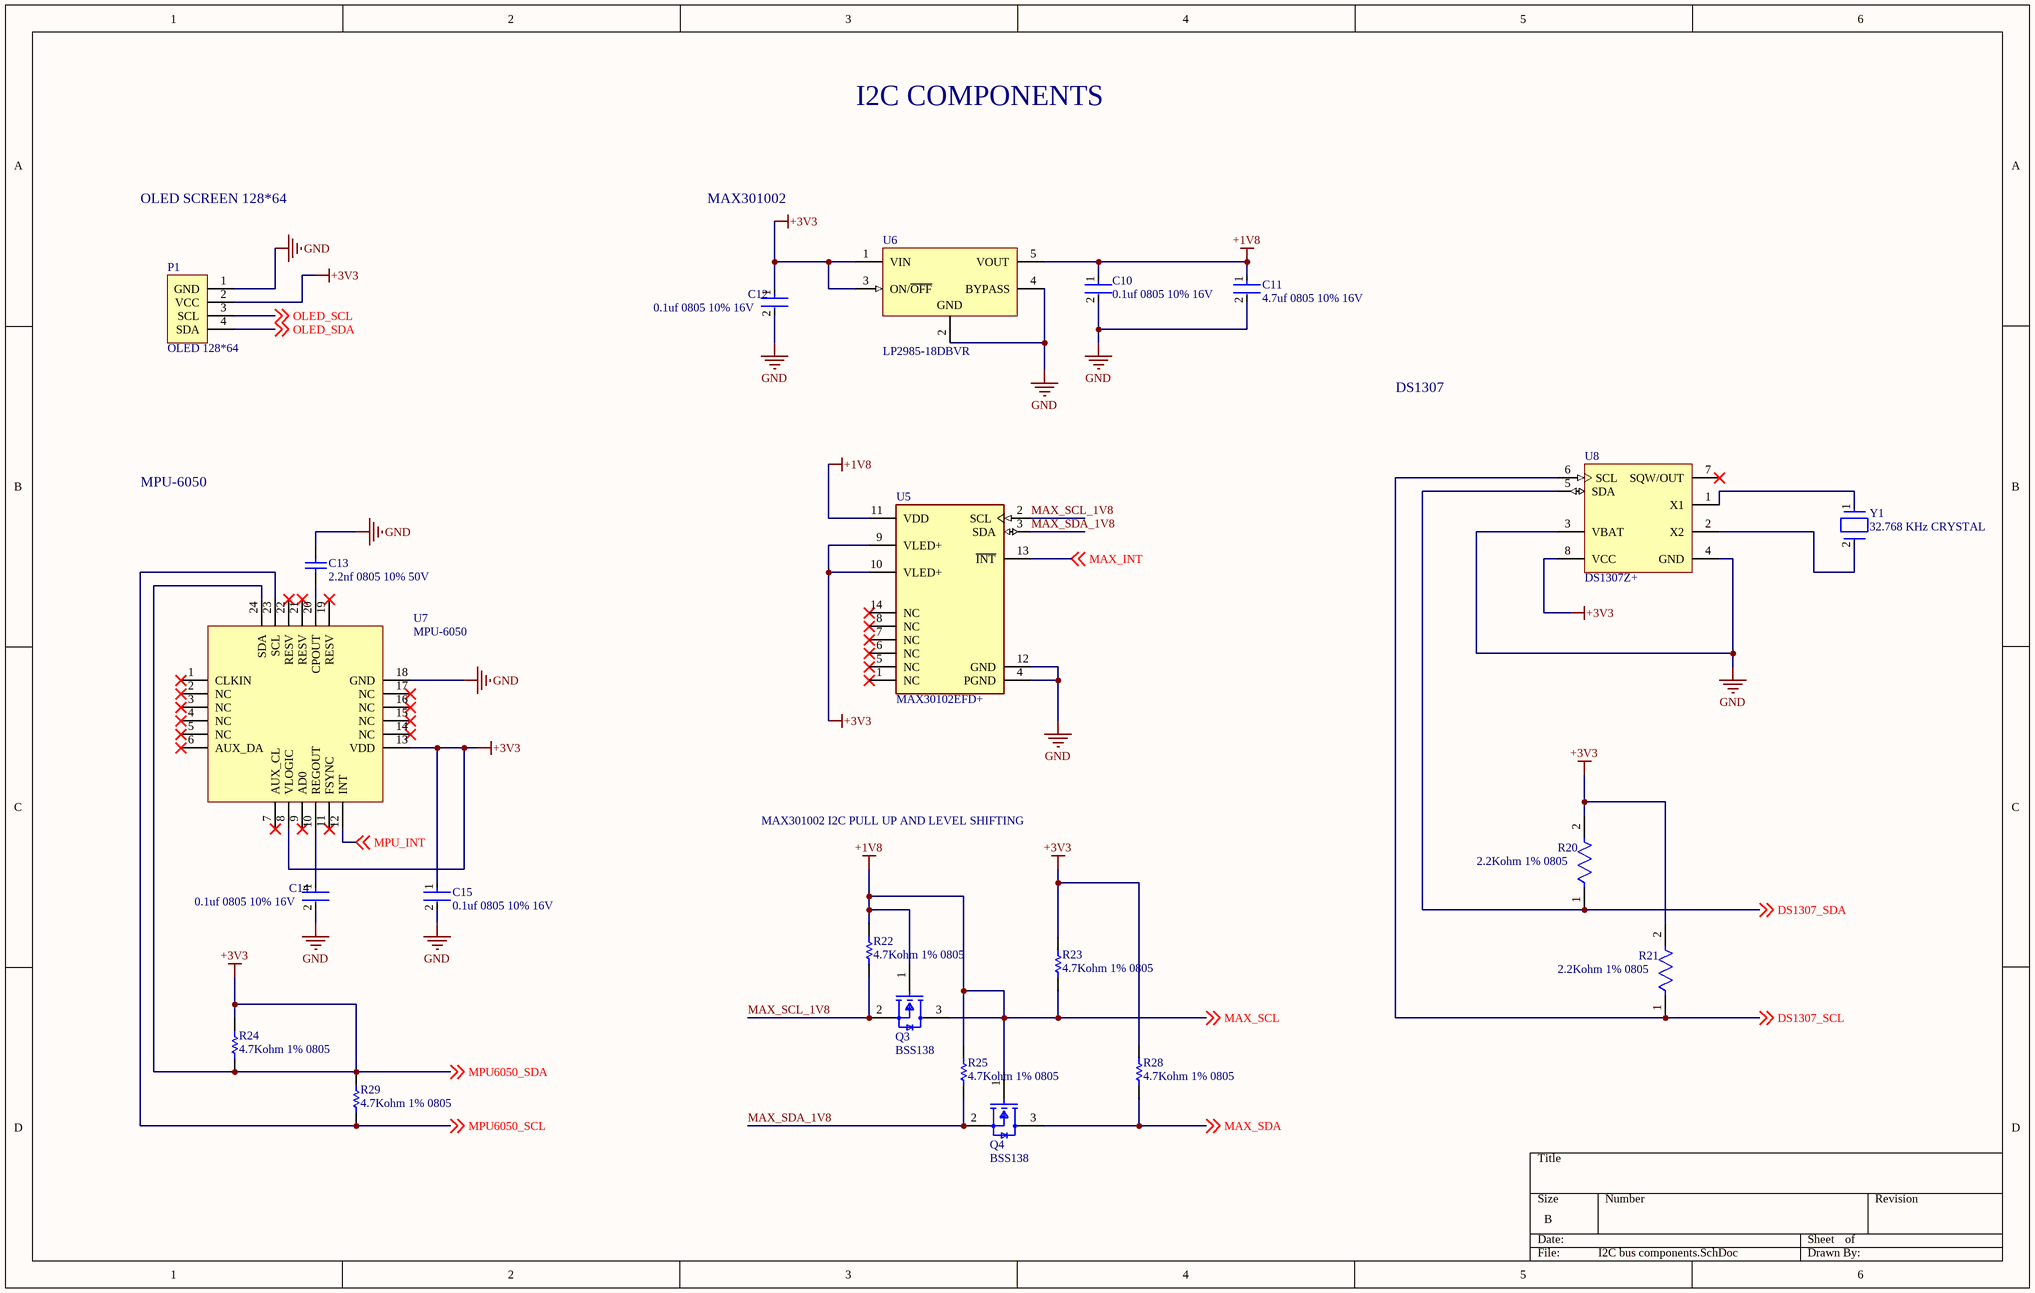
[diagram p2: I2C bus components.SchDoc]

### Parts
C10  0.1uf 0805 10% 16V  [FP-CC0805-0_85-MFG]
C11  4.7uf 0805 10% 16V  [FP-CGA4J-IPC_A]
C12  0.1uf 0805 10% 16V  [FP-CC0805-0_85-MFG]
C13  2.2nf 0805 10% 50V  [CAPC2013X135X50NL15T20]
C14  0.1uf 0805 10% 16V  [FP-CC0805-0_85-MFG]
C15  0.1uf 0805 10% 16V  [FP-CC0805-0_85-MFG]
P1  OLED 128*64  [4pins smd]
Q3  BSS138  [FP-318-08-IPC_B]
Q4  BSS138  [FP-318-08-IPC_B]
R20  2.2Kohm 1% 0805  [FP-RT0805-MFG]
R21  2.2Kohm 1% 0805  [FP-RT0805-MFG]
R22  4.7Kohm 1% 0805  [RESC0805(2012)_M]
R23  4.7Kohm 1% 0805  [RESC0805(2012)_M]
R24  4.7Kohm 1% 0805  [RESC0805(2012)_M]
R25  4.7Kohm 1% 0805  [RESC0805(2012)_M]
R28  4.7Kohm 1% 0805  [RESC0805(2012)_M]
R29  4.7Kohm 1% 0805  [RESC0805(2012)_M]
U5  MAX30102EFD+  [MAX30102]
U6  LP2985-18DBVR  [DBV0005A_M]
U7  MPU-6050  [MPU-6050]
U8  DS1307Z+  [S8+2_L]
Y1  32.768 KHz CRYSTAL  [FP-ECX-34Q-MFG]

### Nets
+1V8: C10.1 C11.1 Q3.1(G) Q3.3(D) Q4.1(G) R22.2 R23.1 R25.2 U5.11(VDD) U6.5(VOUT) ; off-sheet MAX_SCL  [also labelled MAX_SCL]
+3V3: C12.1 C15.1 P1.2(VCC) R20.2 R21.2 R23.2 R24.1 R24.2 R28.2 R29.2 U5.9(VLED+) U5.10(VLED+) U6.1(VIN) U6.3(ON/~{OFF}) U7.8(VLOGIC) U7.13(VDD) U7.24(SDA) U8.8(VCC) ; off-sheet MPU6050_SDA  [also labelled MPU6050_SDA]
GND: C10.2 C11.2 C12.2 C13.2 C14.2 C15.2 P1.1(GND) U5.4(PGND) U5.12(GND) U6.2(GND) U6.4(BYPASS) U7.18(GND) U8.3(VBAT) U8.4(GND)
DS1307_SCL: R21.1 U8.6(SCL) ; off-sheet DS1307_SCL
DS1307_SDA: R20.1 U8.5(SDA) ; off-sheet DS1307_SDA
MAX_INT: U5.13(~{INT}) ; off-sheet MAX_INT
MAX_SCL_1V8: Q3.2(S) R22.1 U5.2(SCL)
MAX_SDA: Q4.3(D) R28.1 ; off-sheet MAX_SDA
MAX_SDA_1V8: Q4.2(S) R25.1 U5.3(SDA)
MPU6050_SCL: R29.1 U7.23(SCL) ; off-sheet MPU6050_SCL
MPU_INT: U7.12(INT) ; off-sheet MPU_INT
OLED_SCL: P1.3(SCL) ; off-sheet OLED_SCL
OLED_SDA: P1.4(SDA) ; off-sheet OLED_SDA
NetC13_1: C13.1 U7.20(CPOUT)
NetC14_1: C14.1 U7.10(REGOUT)
NetU8_1: U8.1(X1) Y1.1(In/Out)
NetU8_2: U8.2(X2) Y1.2(Out/In)

Not connected (* = marked no-connect by the designer): U5 1(NC)* 5(NC)* 6(NC)* 7(NC)* 8(NC)* 14(NC)*; U7 1(CLKIN)* 2(NC)* 3(NC)* 4(NC)* 5(NC)* 6(AUX_DA)* 7(AUX_CL)* 9(AD0)* 11(FSYNC)* 14(NC)* 15(NC)* 16(NC)* 17(NC)* 19(RESV)* 21(RESV)* 22(RESV)*; U8 7(SQW/OUT)*

### Notes on the sheet
- I2C COMPONENTS
- OLED SCREEN 128*64
- MAX301002
- DS1307
- MPU-6050
- MAX301002 I2C PULL UP AND LEVEL SHIFTING

### Library data of the parts
C10 C12 C14 C15 = CMP-1036-04402-6: as C7 on sheet USBdrive_charging; Temperature: -30°C to +85°C; Lead Free: Yes; Footprint Url: http://www.yageo.com/exep/pages/download/literatures/UPY-C_GEN_24.pdf; Voltage Rating: 16 V; Package: CC0805-0.85; RoHS: TRUE; Digikey Description: CAP CER 0.1UF 16V X7R 0805; Category: Cap; Octopart: https://octopart.com/cc0805krx7r7bb104-yageo-39467769; Device Class L3: Ceramic Capacitors; ComponentLink2URL: http://www.yageo.com/documents/recent/UPY-GPHC_Y5V_6.3V-to-50V_8.pdf; Temperature Range Low: -30°C; Mouser Description: Multilayer Ceramic Capacitors MLCC - SMD/SMT 100nF 16V X7R 10%; Automotive: No; Device Class L2: Capacitors; Height: 0.95mm; ComponentLink2Description: Datasheet; Temperature Characteristic: X7R; Ipc Land Pattern Name: CAPC200125X85; Device Class L1: Passive Components; Temperature Range High: +85°C
C11 = CMP-08246-002090-1: as C8 on sheet USBdrive_charging; Lead Free: Lead Free; Weight: 0.000194oz; Composition: Ceramic; Tolerance: 10%; Case/Package: 0805; Min Operating Temperature: -55°C; Case Code (Metric): 2012; Mount: Surface Mount; Thickness: 0.057inch; REACH SVHC: No SVHC; Package Quantity: 1; Termination: SMD/SMT; Max Operating Temperature: 125°C; Length: 2mm; Height: 1.25mm; Width: 0.049inch; Depth: 1.25mm; Dielectric: X7R; Ratings: AEC-Q200; Case Code (Imperial): 0805; Packaging: Tape and Reel; Capacitance: 4.7uF; Radiation Hardening: No; Voltage Rating (DC): 16V; Voltage Rating: 16V
C13 = CMP-2007-03445-1: Manufacturer: Vitramon; Part Number: VJ0805Y222KXACW1BC
Q3 Q4 = CMP-07173-000101-1: MOSFET N-CH 50V 220MA SOT-23; Turn-Off Delay Time: 20ns; Element Configuration: Single; Rds On Max: 3.5R; Gate to Source Voltage (Vgs): 20V; Threshold Voltage: 1.3V; Number of Elements: 1; Power Dissipation: 360mW; Rise Time: 9ns; Turn-On Delay Time: 2.5ns; Input Capacitance: 27pF; On-State Resistance: 6R; Lead Free: Lead Free; Length: 2.92mm; Width: 1.3mm; Drain to Source Breakdown Voltage: 50V; Min Operating Temperature: -55°C; REACH SVHC: No SVHC; Packaging: Tape and Reel; Radiation Hardening: No; Height: 0.93mm; Drain to Source Voltage (Vdss): 50V; Current Rating: 220mA; Voltage Rating (DC): 50V; Weight: 0.03g; Continuous Drain Current (ID): 220mA; Number of Pins: 3; Nominal Vgs: 1.3V; Max Power Dissipation: 360mW; Fall Time: 9ns; Drain to Source Resistance: 3.5R; Contact Plating: Tin; Case/Package: SOT-23; Package Quantity: 1; Dual Supply Voltage: 50V; Mount: Surface Mount; Termination: SMD/SMT; Max Operating Temperature: 150°C
R20 R21 = CMP-03412-009326-1: RES SMD 2.2K OHM 1% 1/8W 0805; Manufacturer Part Number: RT0805FRE072K2L; Manufacturer: Yageo; Tolerance: 0.0001; Power Rating: 0.125W; Voltage Rating: 150V; Temperature Coefficient: 50 ppm/°C; Value: 2.2KΩ; Footprint Url: http://www.yageo.com/exep/pages/download/literatures/PYu-R_Mount_10.pdf; Device Class L3: Chip SMD Resistors; Device Class L2: Resistors; ComponentLink2URL: http://www.yageo.com/documents/recent/PYu-RT_1-to-0.01_RoHS_L_9.pdf; Category: Res; Series: RT; Octopart: https://octopart.com/rt0805fre072k2l-yageo-42273028; Ipc Land Pattern Name: RESC200125X50; ComponentLink2Description: Datasheet; Lead Free: Yes; Temperature Range Low: -55°C; Composition: Thin Film; Temperature: -55°C to +155°C; Digikey Description: RES SMD 2.2K OHM 1% 1/8W 0805; Device Class L1: Passive Components; Temperature Range High: +155°C; Package: RT0805; Automotive: No; Height: 0.6mm; Mouser Description: High Precision-High Stability Chip Resistor Thin Film 0805 2.2kOhm 1% Paper T/R; RoHS: TRUE; Resistance: 2.2KΩ
R22-R25 R28 R29 = CMP-1013-00586-1: 4K7 0.125W 1% 0805 (2012 Metric)  SMD; Case-Metric: 2012; Case-EIA: 0805; Value: 4700.00 Ohm; Technology: SMT; Power: 0.125 W; Tolerance: 1 %
U5 = MAX30102EFD+: IC SENSOR OXIMETER/HEARTRATE; Manufacturer: Maxim; Min Supply Voltage: 1.7V; Max Supply Voltage: 2V; Supplier 1: Digi-Key; Manufacturer Part Number: MAX30102EFD+; RoHS: Yes; Category: Decoders and Multiplexers; Stock 1: 209; Pricing 1: 1=9.76000, 10=8.81500, 25=8.40480, 100=7.29800 (USD); Number of Pins: 14; Min Operating Temperature: -40°C; Max Operating Temperature: 85°C; REACH SVHC: No SVHC; ComponentLink1URL: http://www.farnell.com/datasheets/2162814.pdf?src-supplier=Farnell; ComponentLink1Description: http://www.farnell.com/datasheets/2162814.pdf?src-supplier=Farnell; ComponentLink2URL: http://www.farnell.com/datasheets/2162814.pdf?src-supplier=Element14; ComponentLink2Description: http://www.farnell.com/datasheets/2162814.pdf?src-supplier=Element14; ComponentLink3URL: https://datasheets.maximintegrated.com/en/ds/MAX30102.pdf?src-supplier=Digi-Key; ComponentLink3Description: https://datasheets.maximintegrated.com/en/ds/MAX30102.pdf?src-supplier=Digi-Key
U6 = CMP-0758-00065-2: Single Output Low Noise LDO, 150 mA, Fixed 1.8 V Output, 1.5% Tolerance, 2.2 to 16 V Input, Low IQ, 5-Pin SOT-23 (DBV), -40 to 125 degC, Green (RoHS & no Sb/Br), Tape and Reel; Manufacturer: Texas Instruments; Vdo (Typ) (mV): 280; Iout (Max) (A): 0.15; Output Options: Fixed Output; Iq (Typ) (mA): 0.85; Accuracy (%): 1.5; Fixed Output Options (V): 1.8; PackageReference: DBV0005A; DatasheetVersion: SLVS522N; RoHS: TRUE; ComponentLink1URL: http://www.ti.com/; ComponentLink3URL: http://www.ti.com/litv/pdf/mpds018j; ComponentLink3Description: Package Specification; Operating Temperature Range (degC): -40 to 125; Vin (V): 2.2 to 16; ComponentLink2URL: http://www.ti.com/lit/ds/symlink/lp2985-50.pdf; PartNumber: LP2985-18DBVR; Packing: Tape and Reel; Mounting Technology: Surface Mount; PackageDescription: 5-Pin Plastic Small Outline, Body 2.9 x 1.6 mm, Pitch 0.95 mm; ComponentLink2Description: Datasheet; PackageVersion: 4073253-4/L; ComponentLink1Description: Manufacturer URL
U7 = MPU-6050: INVENSENSE   MPU-6050   GYRO / ACCEL, 6-AXIS, I2C, QFN-24; Manufacturer: TDK InvenSense; Sensor Type: Accelerometer,Gyroscope,3 Axis; Supplier 1: Digi-Key; Manufacturer Part Number: MPU-6050; RoHS: Yes; Category: Inertial Measurement Units (IMUs); Stock 1: 4311; Pricing 1: 1=7.55000, 5=6.62600, 10=5.96300, 25=5.30000, 50=4.90260, 100=4.24000, 500=3.97500, 1000=3.71000 (USD); Mount: Surface Mount; Case/Package: QFN; Min Operating Temperature: -40°C; Max Operating Temperature: 85°C; Packaging: Tape and Reel; Output Type: I2C; ComponentLink1URL: https://datasheet.ciiva.com/1513/1788002-1513632.pdf?src-supplier=Element14; ComponentLink1Description: https://datasheet.ciiva.com/1513/1788002-1513632.pdf?src-supplier=Element14; ComponentLink2URL: https://datasheet.ciiva.com/22731/1788002-22731434.pdf?src-supplier=Element14; ComponentLink2Description: https://datasheet.ciiva.com/22731/1788002-22731434.pdf?src-supplier=Element14; Supplier Part Number 1: 1428-1007-1-ND
U8 = CMP-0254-00308-1: 64 x 8, Serial, I2C Real-Time Clock, 5.0V, 8-Pin SO, 0 to 70 degC, Pb-Free; ComponentLink3Description: Package Specification; DatasheetVersion: 10-Feb-2008; Code_IPC: SOIC127P600-8; ComponentLink2Description: Datasheet; Code_JEDEC: MS-012-AA; ComponentLink2URL: http://datasheets.maxim-ic.com/en/ds/DS1307.pdf; ComponentLink3URL: http://pdfserv.maxim-ic.com/package_dwgs/21-0041.PDF; ComponentLink1URL: http://www.maxim-ic.com; PackageReference: S8+2; ComponentLink1Description: Manufacturer URL; PackageDescription: 8-Pin Small-Outline IC, Narrow (0.15in), 1.27 mm Pitch, SOIC (N), Pb-Free; PackageVersion: revC, 2010
Y1 = CMP-40224-000019-1: CRYSTAL 32.768KHZ 12.5PF SMD; ESR (Equivalent Series Resistance): 80kR; Frequency Tolerance: 10ppm; Case/Package: SMD/SMT; Ratings: AEC-Q200; Width: 0.061inch; Length: 0.126inch; Min Operating Temperature: -40°C; Load Capacitance: 12.5pF; Max Operating Temperature: 125°C; Packaging: Tape and Reel; Height: 0.035inch; Mount: Surface Mount; Frequency: 32.768kHz

## Nets that join several sheets
+1V8: ESP32_connection (U3.14), I2C bus components (10 pins)
+3V3: ESP32_connection (13 pins), USBdrive_charging (5 pins), I2C bus components (18 pins)
GND: ESP32_connection (16 pins), USBdrive_charging (27 pins), I2C bus components (14 pins)
DS1307_SCL: ESP32_connection (U3.11), I2C bus components (R21.1 U8.6)
DS1307_SDA: ESP32_connection (U3.10), I2C bus components (R20.1 U8.5)
ESP32_RX: ESP32_connection (U10.34), USBdrive_charging (U2.20)
ESP32_TX: ESP32_connection (U10.35), USBdrive_charging (U2.4)
GPIO0: ESP32_connection (R7.2 SW1.3 U10.25), USBdrive_charging (Q2.3)
MAX_INT: ESP32_connection (U10.16), I2C bus components (U5.13)
MAX_SDA: ESP32_connection (U3.13), I2C bus components (Q4.3 R28.1)
MPU6050_SCL: ESP32_connection (U3.9), I2C bus components (R29.1 U7.23)
MPU_INT: ESP32_connection (U10.13), I2C bus components (U7.12)
OLED_SCL: ESP32_connection (U3.5), I2C bus components (P1.3)
OLED_SDA: ESP32_connection (U3.4), I2C bus components (P1.4)
RESET: ESP32_connection (R8.2 SW2.3 U10.3), USBdrive_charging (Q1.3)